# EasyEDA schematic SCH_BTP_final_4_2023-04-10.json
TITLE: BTP; REV: 1.0; Date: 2023-03-24; Sheet: 1/1; Company: IIT BHUBANESWAR
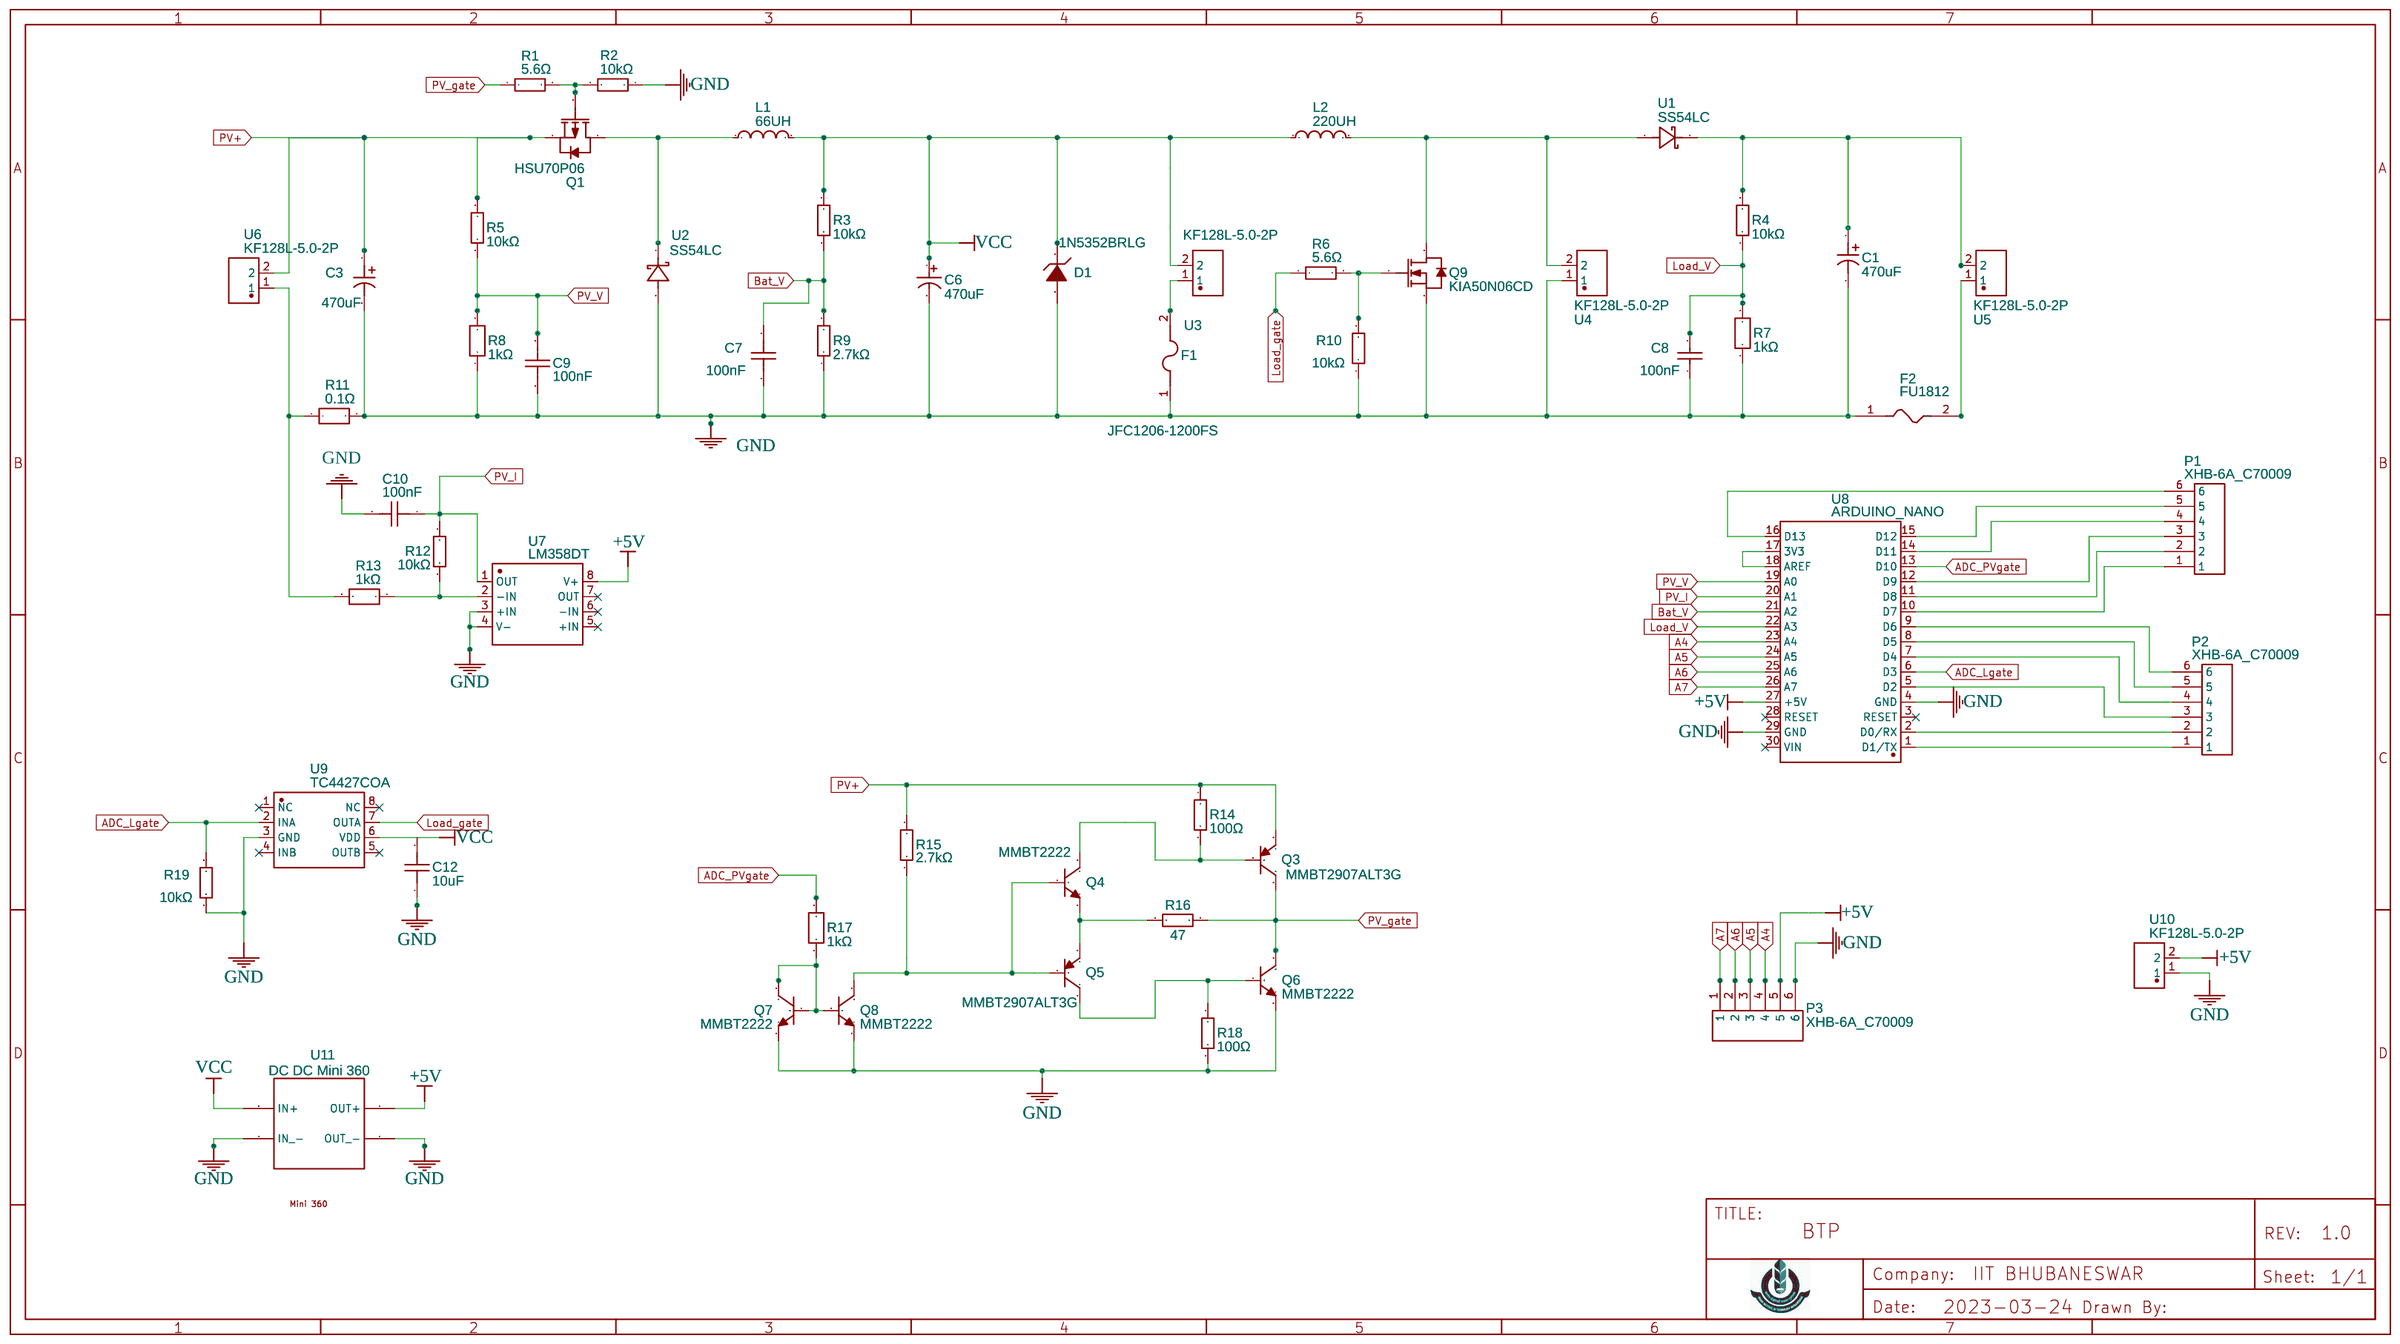
[diagram p0: schematic sheet]

## Parts
C1  470uF  [CAP-TH_BD10.0-P5.00-D0.6-FD]
C3  470uF  [CAP-TH_BD10.0-P5.00-D0.6-FD]
C6  470uF  [CAP-TH_BD10.0-P5.00-D1.0-FD]
C7  100nF  [C0805]
C8  100nF  [C0805]
C9  100nF  [C0805]
C10  100nF  [C0805]
C12  10uF  [C1206]
D1  1N5352BRLG  [DO-27_BD5.2-L8.9-P12.90-D1.5-RD]
F1  JFC1206-1200FS  [F1206]
F2  FU1812  [F1812]
L1  66UH  [IND-TH_L15.5-W7.2-P6.40-D1.0]
L2  220UH  [IND-TH_L15.5-W7.2-P6.40-D1.0]
P1  XHB-6A_C70009  [CONN-TH_6P_XHB-6A]
P2  XHB-6A_C70009  [CONN-TH_6P_XHB-6A]
P3  XHB-6A_C70009  [CONN-TH_6P_XHB-6A]
Q1  HSU70P06  [TO-252-2_L6.6-W6.1-P4.58-LS9.9-BR]
Q3  MMBT2907ALT3G  [SOT-23-3_L2.9-W1.3-P1.90-LS2.4-BR]
Q4  MMBT2222  [SOT-23-3_L2.9-W1.4-P1.91-LS2.6-BR]
Q5  MMBT2907ALT3G  [SOT-23-3_L2.9-W1.3-P1.90-LS2.4-BR]
Q6  MMBT2222  [SOT-23-3_L2.9-W1.4-P1.91-LS2.6-BR]
Q7  MMBT2222  [SOT-23-3_L2.9-W1.4-P1.91-LS2.6-BR]
Q8  MMBT2222  [SOT-23-3_L2.9-W1.4-P1.91-LS2.6-BR]
Q9  KIA50N06CD  [TO-252-2_L6.6-W5.7-P4.6-LS9.9-BR-CW]
R1  5.6Ω  [R0805]
R2  10kΩ  [R0805]
R3  10kΩ  [R0805]
R4  10kΩ  [R0805]
R5  10kΩ  [R0805]
R6  5.6Ω  [R0805]
R7  1kΩ  [R0805]
R8  1kΩ  [R0805]
R9  2.7kΩ  [R0805]
R10  10kΩ  [R0805]
R11  0.1Ω  [R2512]
R12  10kΩ  [R0805]
R13  1kΩ  [R0805]
R14  100Ω  [R0805]
R15  2.7kΩ  [R0805]
R16  47  [R0805]
R17  1kΩ  [R0805]
R18  100Ω  [R0805]
R19  10kΩ  [R0805]
U1  SS54LC  [DO-214AB_L6.9-W5.9-LS7.9-RD]
U2  SS54LC  [DO-214AB_L6.9-W5.9-LS7.9-RD]
U3  KF128L-5.0-2P  [CONN-TH_P5.00_KF128L-5.0-2P]
U4  KF128L-5.0-2P  [CONN-TH_P5.00_KF128L-5.0-2P]
U5  KF128L-5.0-2P  [CONN-TH_P5.00_KF128L-5.0-2P]
U6  KF128L-5.0-2P  [CONN-TH_P5.00_KF128L-5.0-2P]
U7  LM358DT  [SOIC-8_L5.0-W4.0-P1.27-LS6.0-BL]
U8  ARDUINO_NANO  [COMM-TH_ARDUINO_NANO]
U9  TC4427COA  [SOIC-8_L5.0-W4.0-P1.27-LS6.1-BL]
U10  KF128L-5.0-2P  [CONN-TH_P5.00_KF128L-5.0-2P]
U11  DC DC Mini 360  [DC_DC_MINI360]

## Library data of the parts
C1 C3 = 35V470UF CD288: Supplier: LCSC; Supplier Part: C2960252; Manufacturer: HRK(鸿瑞凯电子); Manufacturer Part: 35V470uF CD288; Contributor: LCSC
C6 = 470uF 25V 10*13: Supplier: LCSC; Manufacturer: CX(承兴); Manufacturer Part: KM477M025G13RR0VH2FP0; Supplier Part: C44594; JLCPCB Part Class: Extended Part
C7 C9 C10 = NL0805B104M500CPBN: Supplier: LCSC; Supplier Part: C720961; Manufacturer: HUI JU(汇聚); Contributor: LCSC; JLCPCB Part Class: Extended Part
C8 = C0805X104K101T: Supplier: LCSC; Manufacturer: HEC; Supplier Part: C105951; JLCPCB Part Class: Extended Part
C12 = 12066D106MAT4X: Supplier: LCSC; Supplier Part: C2312016; Manufacturer: Kyocera AVX; Contributor: LCSC; JLCPCB Part Class: Extended Part
D1 = 1N5352BRLG: Supplier: LCSC; Manufacturer: onsemi(安森美); Supplier Part: C9711; JLCPCB Part Class: Extended Part
F1 = JFC1206-1200FS: Supplier: LCSC; Manufacturer: JDTfuse(集电通); Contributor: LCSC; Supplier Part: C136345; JLCPCB Part Class: Extended Part
F2 = FU1812: Supplier: LCSC; Supplier Part: C9900015946; Manufacturer: null; Contributor: lcsc; JLCPCB Part Class: Extended Part
L1 L2 = 47UH/10A: Supplier: LCSC; Supplier Part: C9900026882; Manufacturer: null; Manufacturer Part: 47uH/10A; link: https://atta.szlcsc.comnull; Contributor: lcsc
P1-P3 = XHB-6A_C70009: Supplier: LCSC; Manufacturer: BOOMELE(博穆精密); Manufacturer Part: XHB-6A; Supplier Part: C70009; JLCPCB Part Class: Extended Part
Q1 = HSU70P06: Supplier: LCSC; Supplier Part: C2828492; Manufacturer: HUASHUO(华朔); Contributor: LCSC; JLCPCB Part Class: Extended Part
Q3 Q5 = MMBT2907ALT3G: Supplier: LCSC; Supplier Part: C191231; Manufacturer: onsemi(安森美); Contributor: LCSC
Q4 Q6-Q8 = MMBT2222: Supplier: LCSC; Supplier Part: C2891810; Manufacturer: YONGYUTAI(永裕泰); Contributor: LCSC; JLCPCB Part Class: Extended Part
Q9 = KIA50N06CD: Supplier: LCSC; Supplier Part: C2931913; Manufacturer: KIA; Contributor: LCSC; JLCPCB Part Class: Extended Part
R1 R6 = CR0805J805R6G: Supplier: LCSC; Manufacturer: LIZ(丽智电子); Resistance (Ohms): 5.6; Supplier Part: C102035; JLCPCB Part Class: Extended Part
R2-R5 R10 R12 R19 = MCR10EZPF1002: Supplier: LCSC; Supplier Part: C253445; Manufacturer: ROHM(罗姆); Resistance (Ohms): 10K; Contributor: LCSC; JLCPCB Part Class: Extended Part
R7 R8 R13 R17 = ERJP06F1001V: Supplier: LCSC; Supplier Part: C441981; Manufacturer: PANASONIC(松下); Resistance (Ohms): 1K; Contributor: LCSC; JLCPCB Part Class: Extended Part
R9 = RMC08052.7K5%N: Supplier: LCSC; Supplier Part: C325950; Manufacturer: Tyohm(幸亚电阻); Resistance (Ohms): 2.7K; Contributor: LCSC; JLCPCB Part Class: Extended Part
R11 = CSRN2512FTR100: Supplier: LCSC; Supplier Part: C346817; Manufacturer: SEI(Stackpole Electronics Inc.); Resistance (Ohms): 0.1; Contributor: LCSC; JLCPCB Part Class: Extended Part
R14 R18 = AECR0805F100RK9: Supplier: LCSC; Supplier Part: C328380; Manufacturer: RESI(开步睿思）; Resistance (Ohms): 100; Contributor: LCSC; JLCPCB Part Class: Extended Part
R15 = CR0805F82701G: Supplier: LCSC; Manufacturer: LIZ(丽智电子); Resistance (Ohms): 2.7K; Supplier Part: C101616; JLCPCB Part Class: Extended Part
R16 = AC0805FR-0747RL: Supplier: LCSC; Manufacturer: YAGEO(国巨); Contributor: LCSC; Supplier Part: C144557; JLCPCB Part Class: Extended Part; Resistance: 47Ω
U1 U2 = SS54LC: Supplier: LCSC; Supplier Part: C3033290; Manufacturer: JUXING(钜兴); link: https://atta.szlcsc.com/upload/public/pdf/source/20220610/696DB62591AAF4A9CA4BCF77FF72E08A.pdf; Contributor: lcsc
U3-U6 U10 = KF128L-5.0-2P: Supplier: LCSC; Supplier Part: C474938; Manufacturer: Cixi Kefa Elec; Contributor: LCSC; JLCPCB Part Class: Extended Part
U7 = LM358DT: Supplier: LCSC; Manufacturer: ST(意法半导体); Supplier Part: C9418; JLCPCB Part Class: Extended Part
U8 = ARDUINO_NANO: Supplier: LCSC; Supplier Part: C9900017879; Manufacturer: null; JLCPCB Part Class: Extended Part; Contributor: lcsc
U9 = TC4427COA: Supplier: LCSC; Supplier Part: C636890; Manufacturer: MICROCHIP(美国微芯); link: https://atta.szlcsc.comnull; JLCPCB Part Class: Extended Part; Contributor: lcsc
U11 = DC DC Mini 360: Contributor: stanpak; sourceId: FRLFXR8qI

## Nets
+5V: P3.5 U7.8(V+) U8.27(+5V) U10.2 U11.1(OUT+)
GND: C1.2 C3.2 C6.2 C7.1 C8.1 C9.1 C10.2 C12.1 D1.2(A) F1.1 F2.1 P3.6 Q6.2(E) Q7.2(E) Q8.2(E) Q9.3(S) R2.1 R7.1 R8.1 R9.1 R10.1 R11.2 R18.2 R19.1 U2.2(A) U4.1 U7.3(+IN) U7.4(V-) U8.4(GND) U8.29(GND) U9.3(GND) U10.1 U11.2(OUT -) U11.4(IN -)
VCC: C6.1 C12.2 D1.1(K) L1.2 L2.1 R3.2 U3.2 U9.6(VDD) U11.3(IN+)
A4: P3.4 U8.23(A4)
A5: P3.3 U8.24(A5)
A6: P3.2 U8.25(A6)
A7: P3.1 U8.26(A7)
ADC_Lgate: R19.2 U8.6(D3) U9.2(INA)
ADC_PVgate: R17.2 U8.13(D10)
Bat_V: C7.2 R3.1 R9.2 U8.21(A2)
Load_gate: R6.1 U9.7(OUTA)
Load_V: C8.2 R4.1 R7.2 U8.22(A3)
PV+: C3.1 Q1.3(S) Q3.2(E) R5.2 R14.1 R15.2 U6.2
PV_gate: Q3.3(C) Q6.3(C) R1.1 R16.2
PV_I: C10.1 R12.1 U7.1(OUT) U8.20(A1)
PV_V: C9.2 R5.1 R8.2 U8.19(A0)
Net-(C1-1): C1.1 R4.2 U1.1(K) U5.2
Net-(F1-2): F1.2 U3.1
Net-(F2-2): F2.2 U5.1
Net-(L1-1): L1.1 Q1.2(D) U2.1(K)
Net-(L2-2): L2.2 Q9.2(D) U1.2(A) U4.2
Net-(P1-1): P1.1 U8.10(D7)
Net-(P1-2): P1.2 U8.11(D8)
Net-(P1-3): P1.3 U8.12(D9)
Net-(P1-4): P1.4 U8.14(D11)
Net-(P1-5): P1.5 U8.15(D12)
Net-(P1-6): P1.6 U8.16(D13)
Net-(P2-1): P2.1 U8.1(D1/TX)
Net-(P2-2): P2.2 U8.2(D0/RX)
Net-(P2-3): P2.3 U8.5(D2)
Net-(P2-4): P2.4 U8.7(D4)
Net-(P2-5): P2.5 U8.8(D5)
Net-(P2-6): P2.6 U8.9(D6)
Net-(Q1-1): Q1.1(G) R1.2 R2.2
Net-(Q3-1): Q3.1(B) Q4.3(C) R14.2
Net-(Q4-1): Q4.1(B) Q5.1(B) Q8.3(C) R15.1
Net-(Q4-2): Q4.2(E) Q5.2(E) R16.1
Net-(Q5-3): Q5.3(C) Q6.1(B) R18.1
Net-(Q7-1): Q7.1(B) Q7.3(C) Q8.1(B) R17.1
Net-(Q9-1): Q9.1(G) R6.2 R10.2
Net-(R11-1): R11.1 R13.2 U6.1
Net-(R12-2): R12.2 R13.1 U7.2(-IN)
Net-(U8-17): U8.17(3V3) U8.18(AREF)

Not connected (* = marked no-connect by the designer): U7 5(+IN)* 6(-IN)* 7(OUT)*; U8 3(RESET)* 28(RESET)* 30(VIN)*; U9 1(NC)* 4(INB)* 5(OUTB)* 8(NC)*
